# Altium schematic sheet MCU_Core.SchDoc
size A3; SheetNumber: 3; SheetTotal: 5
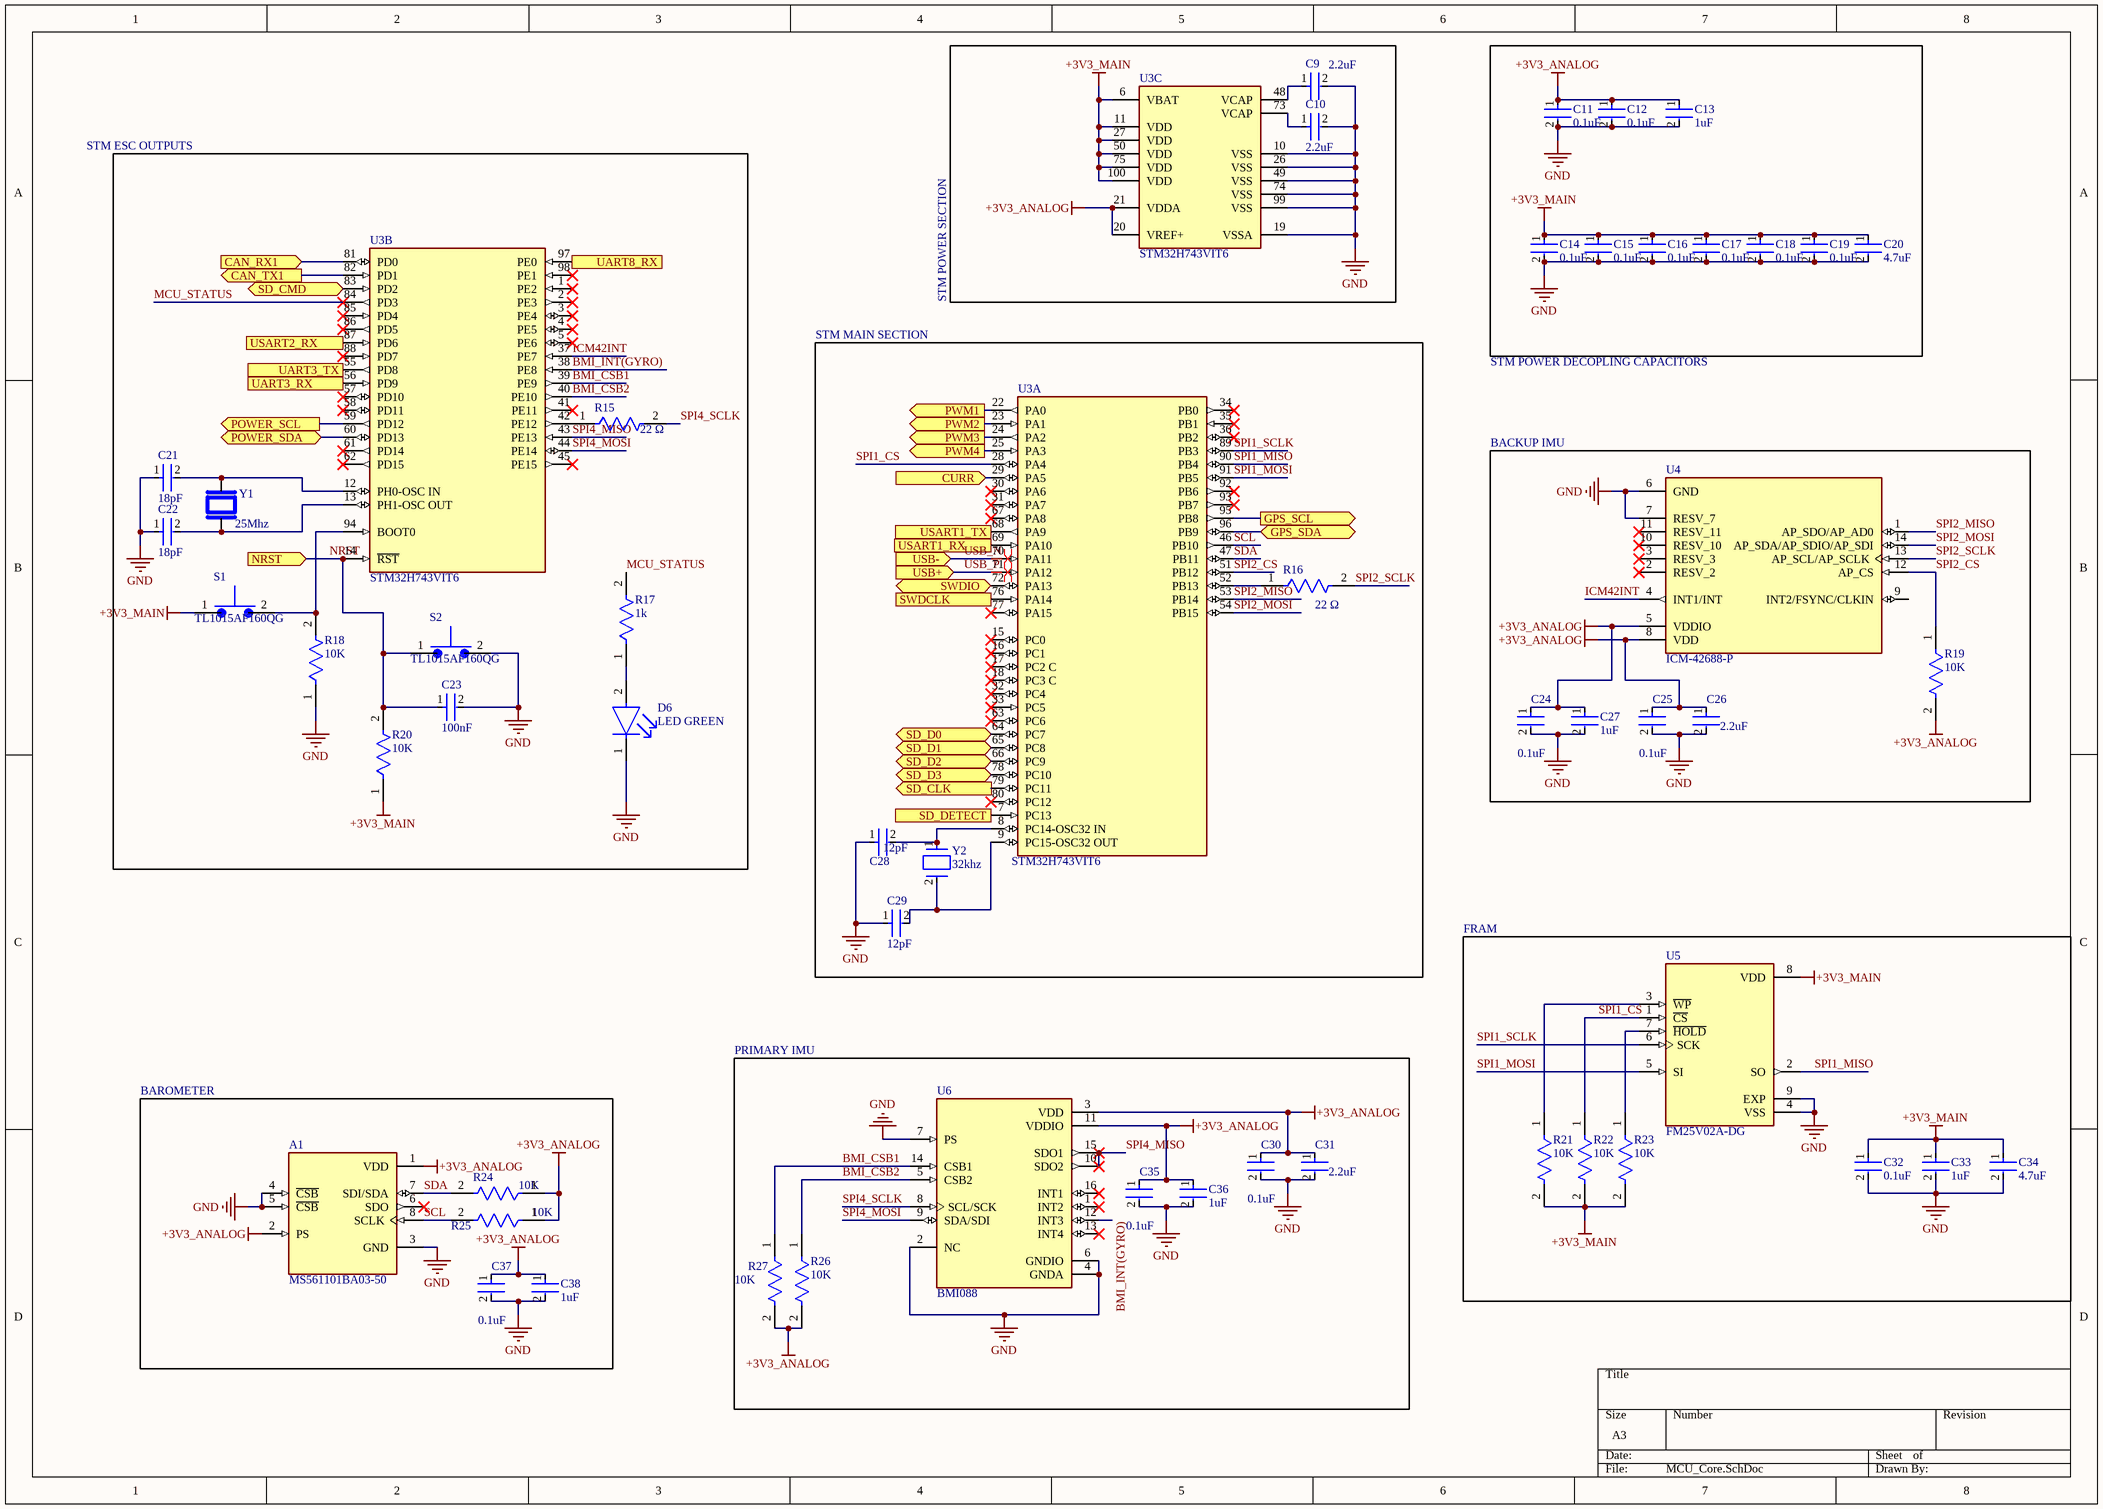
[diagram p0: MCU_Core.SchDoc]

## Parts
A1  MS561101BA03-50  [XDCR_MS561101BA03-50]
C9  2.2uF  [FP-GRM155-0_15-IPC_A]
C10  2.2uF  [FP-GRM155-0_15-IPC_A]
C11  0.1uF  [FP-C0402-BB-MFG]
C12  0.1uF  [FP-C0402-BB-MFG]
C13  1uF  [FP-GRM155-0_05-IPC_B]
C14  0.1uF  [FP-C0402-BB-MFG]
C15  0.1uF  [FP-C0402-BB-MFG]
C16  0.1uF  [FP-C0402-BB-MFG]
C17  0.1uF  [FP-C0402-BB-MFG]
C18  0.1uF  [FP-C0402-BB-MFG]
C19  0.1uF  [FP-C0402-BB-MFG]
C20  4.7uF  [FP-GRT155-0_15-MFG]
C21  18pF  [FP-C0402-BB-MFG]
C22  18pF  [FP-C0402-BB-MFG]
C23  100nF  [FP-C0402-BB-MFG]
C24  0.1uF  [FP-C0402-BB-MFG]
C25  0.1uF  [FP-C0402-BB-MFG]
C26  2.2uF  [FP-GRM155-0_15-IPC_A]
C27  1uF  [FP-GRM155-0_05-IPC_B]
C28  12pF  [FP-C0402-BB-MFG]
C29  12pF  [FP-C0402-BB-MFG]
C30  0.1uF  [FP-C0402-BB-MFG]
C31  2.2uF  [FP-GRM155-0_15-IPC_A]
C32  0.1uF  [FP-C0402-BB-MFG]
C33  1uF  [FP-GRM155-0_05-IPC_B]
C34  4.7uF  [FP-GRT155-0_15-MFG]
C35  0.1uF  [FP-C0402-BB-MFG]
C36  1uF  [FP-GRM155-0_05-IPC_B]
C37  0.1uF  [FP-C0402-BB-MFG]
C38  1uF  [FP-GRM155-0_05-IPC_B]
D6  LED GREEN  [FP-LTST-C171GKT-MFG]
R15  22 Ω  [FP-RMCF0402-MFG]
R16  22 Ω  [FP-RMCF0402-MFG]
R17  1k  [FP-MCS0402-IPC_A]
R18  10K  [FP-MCS0402-MFG]
R19  10K  [FP-MCS0402-MFG]
R20  10K  [FP-MCS0402-MFG]
R21  10K  [FP-MCS0402-MFG]
R22  10K  [FP-MCS0402-MFG]
R23  10K  [FP-MCS0402-MFG]
R24  10K  [FP-MCS0402-MFG]
R25  10K  [FP-MCS0402-MFG]
R26  10K  [FP-MCS0402-MFG]
R27  10K  [FP-MCS0402-MFG]
S1  TL1015AF160QG  [SW_TL1015AF160QG]
S2  TL1015AF160QG  [SW_TL1015AF160QG]
U3  STM32H743VIT6  [FP-LQFP100-1L-MFG]  (parts A,B,C of 3)
U4  ICM-42688-P  [PQFN50P300X250X97-14N]
U5  FM25V02A-DG  [SON95P450X400X80-9N]
U6  BMI088  [PQFN50P450X300X100-16N]
Y1  ABM8N-25.0000MHZ-12-B1U-T3  [XTAL_SXT32412BB07-25.000MT]  (value not drawn)
Y2  32khz  [FP-ABS07-MFG]

## Blocks framed on the sheet
STM POWER SECTION: C9 C10 U3
25Mhz: C21-C23 D6 R15 R17 R18 R20 S1 S2 U3 Y1
STM MAIN SECTION: C28 C29 R16 U3 Y2
BACKUP IMU: C24-C27 R19 U4
FRAM: C32-C34 R21-R23 U5
BAROMETER: A1 C37 C38 R24 R25
PRIMARY IMU: C30 C31 C35 C36 R26 R27 U6

## Ports
CAN_RX1 (in, see EMP_FC_Main[2B], Communication[2D]), CAN_TX1 (out, see EMP_FC_Main[2B], Communication[2C]), CURR (in, see EMP_FC_Main[2C], Motor_Outputs[2B]), GPS_SCL (out, see EMP_FC_Main[3C], Communication[8C]), GPS_SDA (bidir, see EMP_FC_Main[3C], Communication[8C]), NRST (in, see EMP_FC_Main[3B], Communication[8A]), POWER_SCL (out, see EMP_FC_Main[2B], Power_Management[6C]), POWER_SDA (bidir, see EMP_FC_Main[2C], Power_Management[6C]), PWM1 (out, see EMP_FC_Main[2C], Motor_Outputs[3B]), PWM2 (out, see EMP_FC_Main[2C], Motor_Outputs[3B]), PWM3 (out, see EMP_FC_Main[2C], Motor_Outputs[3B]), PWM4 (out, see EMP_FC_Main[2C], Motor_Outputs[3B]), SD_CLK (out, see EMP_FC_Main[2B], Communication[5B]), SD_CMD (bidir, see EMP_FC_Main[2B], Communication[5B]), SD_D0 (bidir, see EMP_FC_Main[2B], Communication[5B]), SD_D1 (bidir, see EMP_FC_Main[2B], Communication[5B]), SD_D2 (bidir, see EMP_FC_Main[2B], Communication[5B]), SD_D3 (bidir, see EMP_FC_Main[2B], Communication[5B]), SD_DETECT (in, see EMP_FC_Main[2B], Communication[5B]), SWDCLK (out, see EMP_FC_Main[3B], Communication[8A]), SWDIO (bidir, see EMP_FC_Main[3B], Communication[8A]), UART3_RX (in, see EMP_FC_Main[2B], Communication[7C]), UART3_TX (out, see EMP_FC_Main[2B], Communication[7C]), UART8_RX (in, see EMP_FC_Main[2C], Motor_Outputs[3B]), USART1_RX (in, see EMP_FC_Main[3C], Communication[6D]), USART1_TX (out, see EMP_FC_Main[3C], Communication[6D]), USART2_RX (in, see EMP_FC_Main[3C], Communication[8B]), USB+ (in, see EMP_FC_Main[3B], Communication[4B]), USB- (in, see EMP_FC_Main[3C], Communication[4A])

## Nets
+3V3_ANALOG: A1.1(VDD) A1.2(PS) C11.1 C12.1 C13.1 C24.1 C25.1 C26.1 C27.1 C30.1 C31.1 C35.1 C36.1 C37.1 C38.1 R19.2 R24.1 R25.1 R26.2 R27.2 U3.20(VREF+) U3.21(VDDA) U4.5(VDDIO) U4.8(VDD) U6.3(VDD) U6.11(VDDIO)
+3V3_MAIN: C14.1 C15.1 C16.1 C17.1 C18.1 C19.1 C20.1 C32.1 C33.1 C34.1 R20.1 R21.2 R22.2 R23.2 S1.1 U3.6(VBAT) U3.11(VDD) U3.27(VDD) U3.50(VDD) U3.75(VDD) U3.100(VDD) U5.8(VDD)
GND: A1.3(GND) A1.4(~{CSB}) A1.5(~{CSB}) C9.2 C10.2 C11.2 C12.2 C13.2 C14.2 C15.2 C16.2 C17.2 C18.2 C19.2 C20.2 C21.1 C22.1 C23.2 C24.2 C25.2 C26.2 C27.2 C28.1 C29.1 C30.2 C31.2 C32.2 C33.2 C34.2 C35.2 C36.2 C37.2 C38.2 D6.1(C) R18.1 S2.2 U3.10(VSS) U3.19(VSSA) U3.26(VSS) U3.49(VSS) U3.74(VSS) U3.99(VSS) U4.6(GND) U4.7(RESV_7) U5.4(VSS) U5.9(EXP) U6.2(NC) U6.4(GNDA) U6.6(GNDIO) U6.7(PS)
BMI_CSB1: R27.1 U3.39(PE9) U6.14(CSB1)
BMI_CSB2: R26.1 U3.40(PE10) U6.5(CSB2)
BMI_INT(GYRO): U3.38(PE8) U6.12(INT3)
CAN_RX1: U3.81(PD0) ; port CAN_RX1
CAN_TX1: U3.82(PD1) ; port CAN_TX1
CURR: U3.29(PA5) ; port CURR
GPS_SCL: U3.95(PB8) ; port GPS_SCL
GPS_SDA: U3.96(PB9) ; port GPS_SDA
ICM42INT: U3.37(PE7) U4.4(INT1/INT)
MCU_STATUS: R17.2 U3.84(PD3)
NRST: C23.1 R20.2 S2.1 U3.14(~{RST}) ; port NRST
POWER_SCL: U3.59(PD12) ; port POWER_SCL
POWER_SDA: U3.60(PD13) ; port POWER_SDA
PWM1: U3.22(PA0) ; port PWM1
PWM2: U3.23(PA1) ; port PWM2
PWM3: U3.24(PA2) ; port PWM3
PWM4: U3.25(PA3) ; port PWM4
SCL: A1.8(SCLK) R25.2 U3.46(PB10)
SD_CLK: U3.79(PC11) ; port SD_CLK
SD_CMD: U3.83(PD2) ; port SD_CMD
SD_D0: U3.64(PC7) ; port SD_D0
SD_D1: U3.65(PC8) ; port SD_D1
SD_D2: U3.66(PC9) ; port SD_D2
SD_D3: U3.78(PC10) ; port SD_D3
SD_DETECT: U3.7(PC13) ; port SD_DETECT
SDA: A1.7(SDI/SDA) R24.2 U3.47(PB11)
SPI1_CS: R22.1 U3.28(PA4) U5.1(~{CS})
SPI1_MISO: U3.90(PB4) U5.2(SO)
SPI1_MOSI: U3.91(PB5) U5.5(SI)
SPI1_SCLK: U3.89(PB3) U5.6(SCK)
SPI2_CS: R19.1 U3.51(PB12) U4.12(AP_CS)
SPI2_MISO: U3.53(PB14) U4.1(AP_SDO/AP_AD0)
SPI2_MOSI: U3.54(PB15) U4.14(AP_SDA/AP_SDIO/AP_SDI)
SPI2_SCLK: R16.2 U4.13(AP_SCL/AP_SCLK)
SPI4_MISO: U3.43(PE13) U6.10(SDO2) U6.15(SDO1)
SPI4_MOSI: U3.44(PE14) U6.9(SDA/SDI)
SPI4_SCLK: R15.2 U6.8(SCL/SCK)
SWDCLK: U3.76(PA14) ; port SWDCLK
SWDIO: U3.72(PA13) ; port SWDIO
UART3_RX: U3.56(PD9) ; port UART3_RX
UART3_TX: U3.55(PD8) ; port UART3_TX
UART8_RX: U3.97(PE0) ; port UART8_RX
USART1_RX: U3.69(PA10) ; port USART1_RX
USART1_TX: U3.68(PA9) ; port USART1_TX
USART2_RX: U3.87(PD6) ; port USART2_RX
USB_N: U3.70(PA11) ; port USB-
USB_P: U3.71(PA12) ; port USB+
NetC9_1: C9.1 U3.48(VCAP)
NetC10_1: C10.1 U3.73(VCAP)
NetC21_2: C21.2 U3.12(PH0-OSC_IN) Y1.3
NetC22_2: C22.2 U3.13(PH1-OSC_OUT) Y1.1
NetC28_2: C28.2 U3.8(PC14-OSC32_IN) Y2.1
NetC29_2: C29.2 U3.9(PC15-OSC32_OUT) Y2.2
NetD6_2: D6.2(A) R17.1
NetR15_1: R15.1 U3.42(PE12)
NetR16_1: R16.1 U3.52(PB13)
NetR18_2: R18.2 S1.2 U3.94(BOOT0)
NetR21_1: R21.1 U5.3(~{WP})
NetR23_1: R23.1 U5.7(~{HOLD})

Not connected (* = marked no-connect by the designer): A1 6(SDO)*; U3 1(PE2)* 2(PE3)* 3(PE4)* 4(PE5)* 5(PE6)* 15(PC0)* 16(PC1)* 17(PC2_C)* 18(PC3_C)* 30(PA6)* 31(PA7)* 32(PC4)* 33(PC5)* 34(PB0)* 35(PB1)* 36(PB2)* 41(PE11)* 45(PE15)* 57(PD10)* 58(PD11)* 61(PD14)* 62(PD15)* 63(PC6)* 67(PA8)* 77(PA15)* 80(PC12)* 85(PD4)* 86(PD5)* 88(PD7)* 92(PB6)* 93(PB7)* 98(PE1)*; U4 2(RESV_2)* 3(RESV_3)* 9(INT2/FSYNC/CLKIN) 10(RESV_10)* 11(RESV_11)*; U6 1(INT2)* 13(INT4)* 16(INT1)*

## Layout directives
differential pair: USB_N, USB_P

## Notes on the sheet
- STM ESC OUTPUTS
- STM POWER DECOPLING CAPACITORS

## Library data of the parts
A1 = MS561101BA03-50: Sensor;MS5611-BT M-CAPS 3X5X1MM T&R;Pressure;MS561101BA03-50 | TE Connectivity MS561101BA03-50; SnapEDA_Link: https://www.snapeda.com/parts/MS561101BA03-50/TE+Connectivity+ALCOSWITCH+Switches/view-part/?ref=snap; Package: SMD-8 Measurement Specialties; Value: *; MF: TE Connectivity; MP: MS561101BA03-50; Check_prices: https://www.snapeda.com/parts/MS561101BA03-50/TE+Connectivity+ALCOSWITCH+Switches/view-part/?ref=eda
C9 C10 C26 C31 = CMP-06035-048202-1: Chip Multilayer Ceramic Capacitors for General Purpose, 0402, 2.2uF, X7R, 15%, 10%, 10V
C11 C12 C14-C19 C23-C25 C30 C32 C35 C37 = CMP-03020-002733-1: CAP CER 0.1UF 10V X7R 0402; Manufacturer: Kemet; Manufacturer Part Number: C0402C104K8RACAUTO; Material: Ceramic; Value: 0.10 μF; Tolerance: 0.1; Temperature Coefficient: 15%; ComponentLink2Description: Datasheet; Automotive: No; Digikey Description: CAP CER 0.1UF 10V X7R 0402; Temperature Range Low: -55°C; Ipc Land Pattern Name: CAPC10050X50; Lead Free: Yes; Category: Cap; Package: C0402-BB; Octopart: https://octopart.com/c0402c104k8racauto-kemet-9145167; Voltage Rating: 10 V; Device Class L2: Capacitors; Capacitance: 0.10 μF; Temperature Range High: +125°C; Height: 0.55mm; ComponentLink2URL: https://content.kemet.com/datasheets/KEM_C1002_X7R_SMD.pdf; Temperature: -55°C to +125°C; Device Class L1: Passive Components; Temperature Characteristic: X7R; RoHS: TRUE; Device Class L3: Ceramic Capacitors
C13 C27 C33 C36 C38 = CMP-06035-009893-1: Chip Multilayer Ceramic Capacitors for General Purpose, 0402, 1.0uF, X7R, 15%, 20%, 6.3V
C20 C34 = CMP-06035-058540-1: Multi-Layer Ceramic Capacitor 4.7uF 10V X5R ±20% 0402 Paper T/R
C21 C22 = CMP-03020-024161-1: C0402 18 pF X8R 5.00% 50 V; Manufacturer: Kemet; Manufacturer Part Number: C0402C180J5HACAUTO; Material: Ceramic; Temperature Coefficient: 15%; Tolerance: 0.05; Voltage Rating: 50 V; Temperature Range Low: -55°C; Octopart: https://octopart.com/c0402c180j5hacauto-kemet-88080534; Device Class L1: Passive Components; Automotive: No; ComponentLink2Description: Datasheet; RoHS: TRUE; Category: Cap; Package: C0402-BB; Temperature Characteristic: X8R; Ipc Land Pattern Name: CAPC10050X50; Temperature Range High: +125°C; Value: 18 pF; Capacitance: 18 pF; Device Class L3: Ceramic Capacitors; ComponentLink2URL: https://content.kemet.com/datasheets/KEM_C1002_X7R_SMD.pdf; Height: 0.55mm; Device Class L2: Capacitors; Temperature: -55°C to +125°C; Lead Free: Yes
C28 C29 = CMP-03020-024996-1: C0402 12 pF X8R 5.00% 50 V; Manufacturer: Kemet; Manufacturer Part Number: C0402C120J5HACTU; Tolerance: 0.05; Temperature Coefficient: 15%; Voltage Rating: 50 V; Material: Ceramic; Device Class L2: Capacitors; Temperature Range Low: -55°C; Temperature Range High: +125°C; Temperature Characteristic: X8R; Device Class L3: Ceramic Capacitors; ComponentLink2Description: Datasheet; Capacitance: 12 pF; Height: 0.55mm; Category: Cap; Package: C0402-BB; Ipc Land Pattern Name: CAPC10050X50; RoHS: TRUE; Lead Free: Yes; Automotive: No; Octopart: https://octopart.com/c0402c120j5hactu-kemet-88724098; Temperature: -55°C to +125°C; Device Class L1: Passive Components; Value: 12 pF; ComponentLink2URL: https://content.kemet.com/datasheets/KEM_C1002_X7R_SMD.pdf
D6 = CMP-22017-000007-1: LED GREEN CLEAR CHIP SMD; Luminous Intensity: 12mcd; Lens Color: Colorless; Dominant Wavelength: 569nm; Number of LEDs: 1; Power Dissipation: 100mW; Viewing Angle: 130°; Reverse Voltage: 5V; Test Current: 10mA; Forward Voltage: 2.1V; Wavelength: 585nm; Lens Style: Diffused; Forward Current: 30mA; Height: 0.8mm; Mount: Surface Mount; Package Quantity: 1; Length: 2mm; Case Code (Metric): 2012; Number of Pins: 2; Number of Elements: 1; Packaging: Tape and Reel; Color: Green; Min Operating Temperature: -55°C; Case/Package: 0805; Power Rating: 100mW; Max Operating Temperature: 85°C; Radiation Hardening: No; Depth: 1.25mm; Lens Transparency: Clear; Width: 1.25mm; Lead Free: Lead Free; Case Code (Imperial): 0805; Illumination Color: Green
R15 R16 = CMP-26527-006952-1: 22Ω ±1% 0.063W 0402 Thick Film Chip Resistor AEC-Q200 compliant; Temperature Coefficient: 100ppm/°C; Resistance: 22R; Max Power Dissipation: 63mW; RoHS Compliant: Yes; Min Operating Temperature: -55°C; Features: Automotive AEC-Q200; Max Operating Temperature: 155°C; Number of Terminations: 2; Length: 0.039inch; Height: 0.016inch; Tolerance: 1%; Packaging: Tape and Reel; Width: 0.02inch; Resistor Type: Thick Film; Contact Plating: Tin; Case/Package: 0402; Series: RMCF; Mount: Surface Mount
R17 = CMP-02407-001712-1: RES SMD 1.2K OHM 1% 1/10W 0402; Tolerance: 0.5%; Temperature Coefficient: 25ppm/°C; Max Power Dissipation: 200mW; Resistance: 1kR; Case Code (Metric): 1005; Min Operating Temperature: -55°C; Max Operating Temperature: 175°C; Features: Automotive AEC-Q200; Composition: Thin Film; Case Code (Imperial): 0402; Number of Terminations: 2; Case/Package: 0402; Packaging: Cut Tape
R18-R27 = CMP-02407-000363-1: RES SMD 1.2K OHM 1% 1/10W 0402; Power Rating: 100mW; Temperature Coefficient: 25ppm/°C; Tolerance: 0.5%; Voltage Rating: 50V; Resistance: 10kR; Package Quantity: 10000; Case Code (Metric): 1005; Height: 0.015inch; Termination: SMD/SMT; Features: Automotive AEC-Q200; Packaging: Tape and Reel; Length: 0.039inch; Min Operating Temperature: -55°C; Case/Package: 0402; Max Power Dissipation: 100mW; Case Code (Imperial): 0402; Width: 0.5mm; Contact Plating: Tin; Weight: 2.1E-05oz; Max Operating Temperature: 175°C; Composition: Thin Film; Number of Terminations: 2; Radiation Hardening: No
S1 S2 = TL1015AF160QG: Tactile Switch SPST-NO Top Actuated Surface Mount; Package: None; Availability: Unavailable; Value: *; MP: TL1015AF160QG; Price: None
U3 = CMP-12105-000050-1: IC MCU 32BIT 2MB FLASH 100LQFP; Manufacturer: STMicroelectronics; Number Of Ethernet Channels: 1; Number Of Usb Channels: 2; Number Of A/D Converters: 3; Min Supply Voltage: 1.71V; Ram Size: 1060KBytes; Number Of I2C Channels: 4; Frequency: 480MHz; Number Of Adc Channels: 36; Number Of I/Os: 82; Max Supply Voltage: 3.6V; Number Of Spi Channels: 6; Memory Size: 2MBytes; Max Junction Temp: +125°C; Core Architecture: Arm Cortex-M7; Interface: I2C,SPI,UART,USART,USB,LIN,IrDA,Ethernet,I2S,Other; Number Of Timers/Counters: 20; Data Bus Width: 32bits; Number Of Pwm Channels: 42; Number Of Uart Channels: 9; Standoff Height: 0.05mm; Device Class L1: Integrated Circuits (ICs); ComponentLink2URL: https://www.st.com/resource/en/datasheet/stm32h743vi.pdf; Automotive: No; Memory Type: FLASH; Number Of Cores: 1; Temperature Range Low: -40°C; RoHS: TRUE; Ambient Temperature Range Low: -40°C; ComponentLink2Description: Datasheet; Device Class L2: Embedded Processors and Controllers; Device Class L3: Microcontrollers; Digikey Description: IC MCU 32BIT 2MB FLASH 100LQFP; Temperature Range High: +125°C; Ambient Temperature Range High: +85°C; Package: LQFP100-1L; Temperature: -40°C to +125°C; Category: IC; Ipc Land Pattern Name: QFP50P1600X1600X160-100; Height: 1.6mm; Manufacturer Part Number: STM32H743VIT6; Octopart: https://octopart.com/stm32h743vit6-stmicroelectronics-76372527; Lead Free: Yes
U4 = ICM-42688-P: Accelerometer, Gyroscope, 6 Axis Sensor Output; Package: None; MP: ICM-42688-P; Value: *; Availability: Unavailable; Price: None
U5 = FM25V02A-DG: FRAM (Ferroelectric RAM) Memory IC 256Kb (32K x 8) SPI 40 MHz 8-DFN (4x4.5); MF: Cypress Semiconductor; SnapEDA_Link: https://www.snapeda.com/parts/FM25V02A-DG/Infineon/view-part/?ref=snap; Package: TDFN-8 Cypress Semiconductor; Value: *; MP: FM25V02A-DG; Check_prices: https://www.snapeda.com/parts/FM25V02A-DG/Infineon/view-part/?ref=eda
U6 = BMI088: High-performance 6-axis inertial sensor (accelerometer + gyroscope) <a href="https://pricing.snapeda.com/parts/BMI088/Bosch%20Sensortec/view-part?ref=eda">Check prices</a>; Package: None; MP: BMI088; Value: *; Availability: Unavailable; Price: None
Y1 = SXT32412BB07-25.000MT: 25 MHz Â±30ppm Crystal 12pF 50 Ohms 4-SMD, No Lead; MF: Suntsu; SnapEDA_Link: https://www.snapeda.com/parts/SXT32412BB07-25.000M/Suntsu/view-part/?ref=snap; Package: NON STANDARD-4 Suntsu; Value: *; MP: SXT32412BB07-25.000M; Check_prices: https://www.snapeda.com/parts/SXT32412BB07-25.000M/Suntsu/view-part/?ref=eda; Supplier 1: DigiKey; Supplier Part Number 1: 535-ABM8N-25.0000MHZ-12-B1U-T3CT-ND
Y2 = CMP-0447-00001-4: Crystal 32.768kHz ±20ppm (Tol) 12.5pF FUND 70kΩ 2-Pin CSMD T/R; ESR (Equivalent Series Resistance): 70kR; Radiation Hardening: No; Frequency: 32.768kHz; Length: 3.2mm; Max Operating Temperature: 85°C; Number of Pins: 2; Series: ABS07; Min Operating Temperature: -40°C; Frequency Tolerance: 20ppm; Packaging: Tape and Reel; Height: 0.9mm; Width: 1.5mm; Depth: 1.5mm; Load Capacitance: 12.5pF; RoHS Compliant: Yes; Tolerance: 20ppm; Termination: SMD/SMT; Lead Free: Lead Free; Series Resistance: 70kR; REACH SVHC: No SVHC; Case/Package: CSMD; Operating Frequency: 32.768 kHz; Package Quantity: 3000